# Altium project Project2.PrjPcb
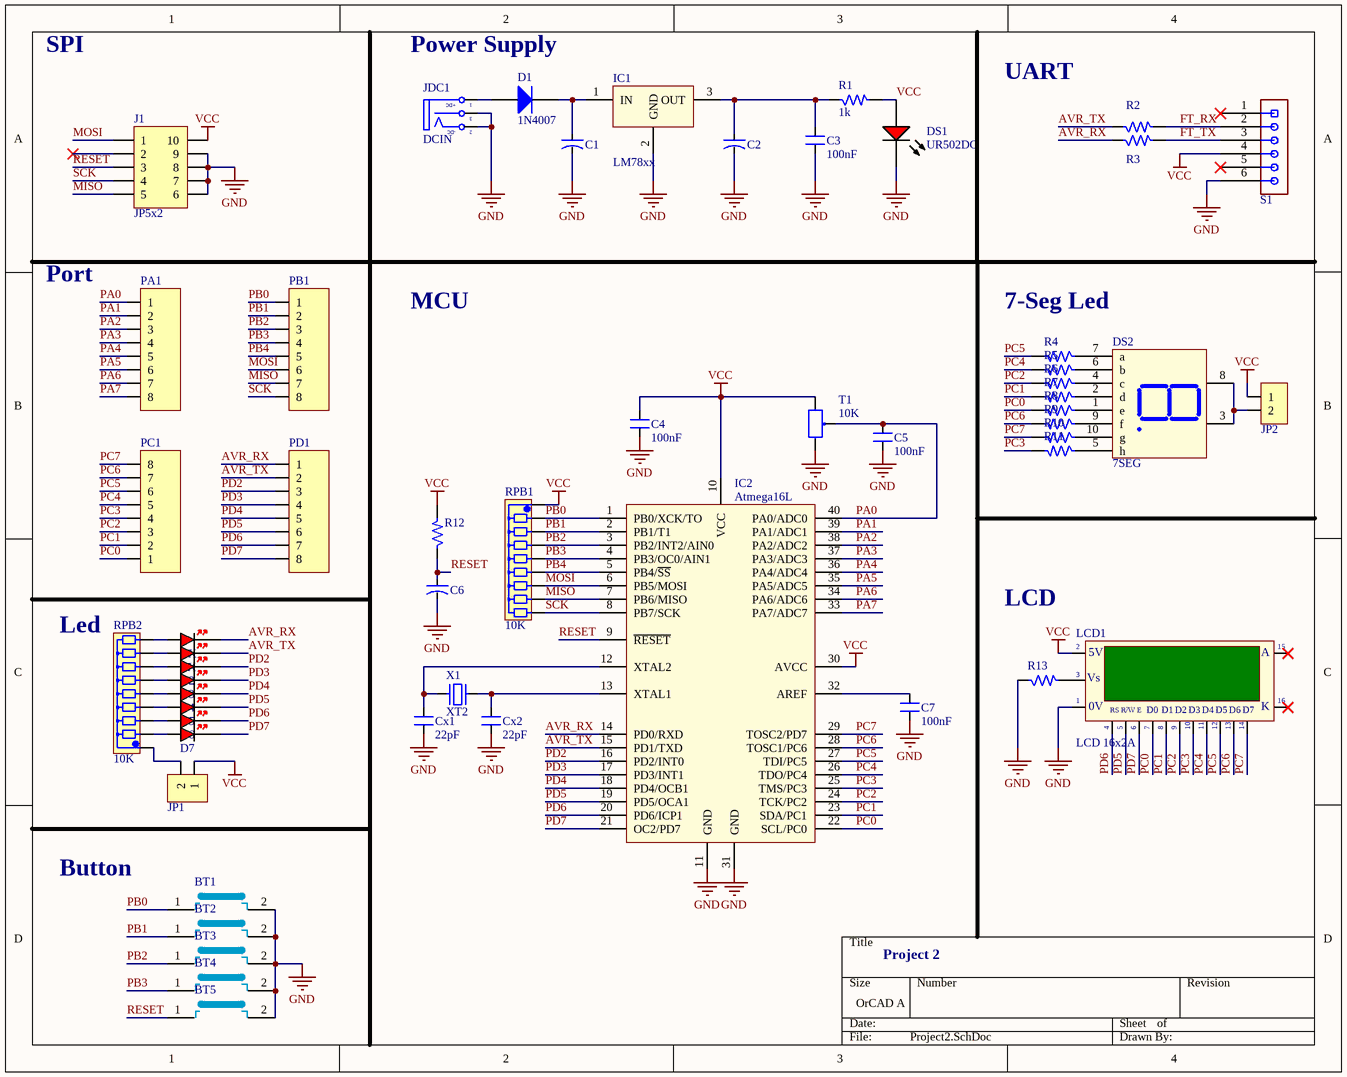
[diagram p0: Project2.SchDoc]
1 sheet, 54 parts. Net scope: global (net labels, ports and power ports of the same name join across sheets).
Board file: Project2.PcbDoc

## Sheet Project2.SchDoc: Project 2
size OrCAD A; SheetNumber: 1; SheetTotal: 1

### Parts
BT1  BT  [SW4]  (value not drawn)
BT2  BT  [SW4]  (value not drawn)
BT3  BT  [SW4]  (value not drawn)
BT4  BT  [SW4]  (value not drawn)
BT5  BT  [SW4]  (value not drawn)
C1  CN-ALU-DIP  [CA-ALU-8]  (value not drawn)
C2  CN-ALU-DIP  [CA-ALU-8]  (value not drawn)
C3  value 100nF  [CN1.5]  (hidden comment: CN1.5)
C4  value 100nF  [CN1.5]  (hidden comment: CN1.5)
C5  value 100nF  [CN1.5]  (hidden comment: CN1.5)
C6  CN-ALU-DIP  [CA-ALU-5W]  (value not drawn)
C7  value 100nF  [CN1.5]  (hidden comment: CN1.5)
Cx1  value 22pF  [CN1]  (hidden comment: CN0)
Cx2  value 22pF  [CN1]  (hidden comment: CN0)
D1  1N4007  [FAIR-DO-41-2]
D2  Led Flat  [Led Flat]  (value not drawn)
D3  Led Flat  [Led Flat]  (value not drawn)
D4  Led Flat  [Led Flat]  (value not drawn)
D5  Led Flat  [Led Flat]  (value not drawn)
D6  Led Flat  [Led Flat]  (value not drawn)
D7  Led Flat  [Led Flat]  (value not drawn)
DS1  UR502DC  [CGX-UR502DC]
DS2  7SEG  [LED7SEG-1-0.56]
IC1  LM78xx  [QTO-220H3]
IC2  Atmega16L  [DIP40PIN]
J1  JP5x2  [JP5-D2T]
JDC1  DCIN  [DC-IN]
JP1  JP1  [JP2-CLOSED]  (value not drawn)
JP2  JP2  [JP2-CLOSED]  (value not drawn)
LCD1  LCD 16x2A  [LCD16X2N]
PA1  JP 1x8 2.54  [JP 1x8 DT]  (value not drawn)
PB1  JP 1x8 2.54  [JP 1x8 DT]  (value not drawn)
PC1  JP 1x8 2.54  [JP 1x8 DT]  (value not drawn)
PD1  JP 1x8 2.54  [JP 1x8 DT]  (value not drawn)
R1  1k  [R1/4W]
R2  R  [R1/4W]  (value not drawn)
R3  R  [R1/4W]  (value not drawn)
R4  R  [R1/4W]  (value not drawn)
R5  R  [R1/4W]  (value not drawn)
R6  R  [R1/4W]  (value not drawn)
R7  R  [R1/4W]  (value not drawn)
R8  R  [R1/4W]  (value not drawn)
R9  R  [R1/4W]  (value not drawn)
R10  R  [R1/4W]  (value not drawn)
R11  R  [R1/4W]  (value not drawn)
R12  R  [R1/4W]  (value not drawn)
R13  R  [R1/4W]  (value not drawn)
RPB1  10K  [RN8]
RPB2  10K  [RN8]
RX  Led Flat  [Led Flat]  (value not drawn)
S1  Socket 6P1R  [Socket 6P1R Vertical]  (value not drawn)
T1  10K  [BIEN TRO VI CHINH NAM]
TX  Led Flat  [Led Flat]  (value not drawn)
X1  XT2  [XT2]

### Nets
GND: BT1.2 BT2.2 BT3.2 BT4.2 BT5.2 C1.2 C2.2 C3.1 C4.1 C5.1 C6.2 C7.1 Cx1.1 Cx2.1 DS1.2(K) IC1.2(GND) IC2.11(GND) IC2.31(GND) J1.6 J1.7 J1.8 J1.9 JDC1.2(TN) JDC1.3(S) LCD1.1(GND) R13.1 S1.6 T1.3
VCC: C4.2 DS1.1(A) IC2.10(VCC) IC2.30(AVCC) J1.10 JP1.1 JP2.1 LCD1.2(VDD) R1.2 R12.2 RPB1.1 S1.4 T1.1
AVR_RX: IC2.14(PD0/RXD) PD1.1 R3.1 RX.K
AVR_TX: IC2.15(PD1/TXD) PD1.2 R2.1 TX.K
FT_RX: R2.2 S1.2
FT_TX: R3.2 S1.3
MISO: IC2.7(PB6/MISO) J1.5 PB1.7 RPB1.8
MOSI: IC2.6(PB5/MOSI) J1.1 PB1.6 RPB1.7
PA0: C5.2 IC2.40(PA0/ADC0) PA1.1 T1.2
PA1: IC2.39(PA1/ADC1) PA1.2
PA2: IC2.38(PA2/ADC2) PA1.3
PA3: IC2.37(PA3/ADC3) PA1.4
PA4: IC2.36(PA4/ADC4) PA1.5
PA5: IC2.35(PA5/ADC5) PA1.6
PA6: IC2.34(PA6/ADC6) PA1.7
PA7: IC2.33(PA7/ADC7) PA1.8
PB0: BT1.1 IC2.1(PB0/XCK/TO) PB1.1 RPB1.2
PB1: BT2.1 IC2.2(PB1/T1) PB1.2 RPB1.3
PB2: BT3.1 IC2.3(PB2/INT2/AIN0) PB1.3 RPB1.4
PB3: BT4.1 IC2.4(PB3/OC0/AIN1) PB1.4 RPB1.5
PB4: IC2.5(PB4/~{SS}) PB1.5 RPB1.6
PC0: IC2.22(SCL/PC0) LCD1.7(D0) PC1.1 R8.2
PC1: IC2.23(SDA/PC1) LCD1.8(D1) PC1.2 R7.2
PC2: IC2.24(TCK/PC2) LCD1.9(D2) PC1.3 R6.2
PC3: IC2.25(TMS/PC3) LCD1.10(D3) PC1.4 R11.2
PC4: IC2.26(TDO/PC4) LCD1.11(D4) PC1.5 R5.2
PC5: IC2.27(TDI/PC5) LCD1.12(D5) PC1.6 R4.2
PC6: IC2.28(TOSC1/PC6) LCD1.13(D6) PC1.7 R9.2
PC7: IC2.29(TOSC2/PD7) LCD1.14(D7) PC1.8 R10.2
PD2: D2.K IC2.16(PD2/INT0) PD1.3
PD3: D3.K IC2.17(PD3/INT1) PD1.4
PD4: D4.K IC2.18(PD4/OCB1) PD1.5
PD5: D5.K IC2.19(PD5/OCA1) LCD1.5(R/~{W}) PD1.6
PD6: D6.K IC2.20(PD6/ICP1) LCD1.4(RS) PD1.7
PD7: D7.K IC2.21(OC2/PD7) LCD1.6(~{EN}) PD1.8
RESET: BT5.1 C6.1 IC2.9(~{RESET}) J1.3 R12.1
SCK: IC2.8(PB7/SCK) J1.4 PB1.8 RPB1.9
NetC1_1: C1.1 D1.1(K) IC1.1(IN)
NetC2_1: C2.1 C3.2 IC1.3(OUT) R1.1
NetC7_2: C7.2 IC2.32(AREF)
NetCx1_2: Cx1.2 IC2.12(XTAL2) X1.1
NetCx2_2: Cx2.2 IC2.13(XTAL1) X1.2
NetD1_2: D1.2(A) JDC1.1(T)
NetD2_A: D2.A RPB2.7
NetD3_A: D3.A RPB2.6
NetD4_A: D4.A RPB2.5
NetD5_A: D5.A RPB2.4
NetD6_A: D6.A RPB2.3
NetD7_A: D7.A RPB2.2
NetDS2_1: DS2.1(e) R8.1
NetDS2_2: DS2.2(d) R7.1
NetDS2_3: DS2.3(Vcc) DS2.8(Vcc) JP2.2
NetDS2_4: DS2.4(c) R6.1
NetDS2_5: DS2.5(h) R11.1
NetDS2_6: DS2.6(b) R5.1
NetDS2_7: DS2.7(a) R4.1
NetDS2_9: DS2.9(f) R9.1
NetDS2_10: DS2.10(g) R10.1
NetJP1_2: JP1.2 RPB2.1
NetLCD1_3: LCD1.3(VEE) R13.2
NetRPB2_8: RPB2.8 TX.A
NetRPB2_9: RPB2.9 RX.A

Not connected (* = marked no-connect by the designer): J1 2*; LCD1 15(A)* 16(K)*; S1 1* 5*

### Notes on the sheet
- SPI
- Power Supply
- UART
- (near PA1) Port
- MCU
- 7-Seg Led
- LCD
- Led
- Button
- (in symbol CMP-007-000003-1) +DC; -DC
- (in symbol LCD16x2A) 5V; Vs; |; 0V; R/W; E

### Library data of the parts
BT1-BT5 = BUTTON
C1 C2 = CN-ALU-DIP: Capacitor (Semiconductor SIM Model); Value: 104; LatestRevisionDate: 17-Jul-2002; LatestRevisionNote: Re-released for DXP Platform.; PackageReference: C1206; Publisher: Altium Limited
C3-C5 C7 = CMP-001-00086-1: Cap np Cremic  682pF => 104 pF; Design Item ID: CN1.5; Component Type: Standard; Source: syhaunguyen.SchLib; Pins: 2
C6 = CN-ALU-DIP: Capacitor (Semiconductor SIM Model); pin to pad: 1>2 2>1; Value: 104; LatestRevisionDate: 17-Jul-2002; LatestRevisionNote: Re-released for DXP Platform.; PackageReference: C1206; Publisher: Altium Limited
Cx1 Cx2 = CMP-001-00084-1: Cap np Cremic value 1pF => 100pF; Pins: 2; Component Type: Standard; Source: syhaunguyen.SchLib; Design Item ID: CN0
D1 = CMP-004-00007-2: General Purpose Rectifier, 1.1 V, 1.0 A, -55 to 175 degC, 2-Pin DO-41, RoHS, Tape and Reel; Manufacturer: Fairchild; Peak Reverse Current: 5uA; Max Surge Current: 30A; Elements: 1; Forward Voltage: 1.1V; Package Version: Rev. 2, 09/2008; Forward Current: 1A; Package Quantity: 5000; Packaging: TapeandReel; Package URL: http://www.fairchildsemi.com/dwg/DO/DO41A.pdf; Manufacturer URL: https://www.fairchildsemi.com/; Package Reference: DO-41-2; Pins: 2; Min Operating Temperature: -55°C; Datasheet Version: Rev. 1.1.0, 11/2014; Max Operating Temperature: 175°C; RoHS Compliant: True; Case/Package: DO-41-2; Mounting Technology: TH; Package Description: 2-Pin Axial Lead, Dia 2.375 mm, Body Length 4.63 mm; Datasheet URL: https://www.fairchildsemi.com/datasheets/1N/1N4007.pdf
D2-D7 RX TX = Led Flat: Led Flat 2x5mm
DS1 = CMP-007-00009-2: Red LED, 80 mW, 30 mA, -25 to 85 degC, 2-Pin THD; Manufacturer: Shenzhen CGX; Power: 80mW; Case/Package: UR502DC; RoHS Compliant: Unknown; Package Description: 2-Pin Through Hole Device, Dia 5.9 mm, Height 9.1 mm; Manufacturer URL: http://szcgx.com/; Datasheet Version: Sep-14; Package Reference: UR502DC; Datasheet URL: http://datasheet.octopart.com/UR502DC-Chengguangxing-datasheet-62330342.pdf; Mounting Technology: TH
DS2 = LED7SEG-1: 14.2 mm General Purpose Blue 7-Segment Display: CC, RH DP, Gray Surface; MinimumIntensity: 2020 ucd; Note: IF = 10 mA; Published: 8-Jun-2000; LatestRevisionDate: 17-Dec-2003; LatestRevisionNote: Schematic revised, PCB Footprint replaced.; DatasheetDocument: 24-Sep-2002; PackageDocument: 24-Sep-2002; PackageReference: H; Publisher: Altium Limited; Colour: Blue; ComponentLink1Description: Manufacturer Link; ComponentLink1URL: http://www.agilent.com/
IC1 = CMP-031-00092-2: Low-Power Dual Operational Amplifier; Value: LM358; Source: syhaunguyen.SchLib; Component Type: Standard; Pins: 8; Design Item ID: LM78xx
IC2 = CMP-031-00059-3: 8-Bit AVR Microcontroller with 16K Bytes of In-System Programmable Flash Memory; Component Type: Standard; Value: Atmega 16L; Source: syhaunguyen.SchLib; Pins: 40; Design Item ID: Atmega16L
J1 = JP5x2: WR-PHD 2.54 mm Dual Socket Header; Manufacturer: W¨¹rth Elektronik eiSos GmbH; partNo: 61301021821; ComponentLink1 Description: Manufacturer; ComponentLink2 Description: Datasheet; NoPins: 10; Created Date: 29 March 2013; ComponentLink1URL: http://www.we-online.com; ComponentLink2URL: http://katalog.we-online.de/em/datasheet/6130xx21821.pdf; Created by: Karrer Zheng
JDC1 = CMP-007-000003-1: Jac DC input; Value: Jac DC; Component Type: Standard; Pin Count: 3; Source: syhaunguyen.SchLib; Design Item ID: DCIN
JP1 JP2 = JP2: WR-PHD 2.54 mm Angled Socket Header; Manufacturer: W¨¹rth Elektronik eiSos GmbH; partNo: 613002143121; ComponentLink1 Description: Manufacturer; ComponentLink2 Description: Datasheet; NoPins: 02; Created Date: 29 March 2013; ComponentLink1URL: http://www.we-online.com; ComponentLink2URL: http://katalog.we-online.de/em/datasheet/6130xx143121.pdf; Created by: Karrer Zheng
LCD1 = LCD16x2A: LCD dipslay 16 char, 2 line; Value: LCD16x2A
PA1 PB1 PC1 PD1 = JP 1x8 2.54 Duc Thang: Cắm; Ten_Linh_Kien: Jump Đơn Đực 2.54MM 1x40P Thẳng 11MM; Don_Vi: Con; Ma_Hang: MH000903; Ghi_Chu: *; Kieu_Chan: *; Chung_Loai: Cắm
R1 = R: Resistor 1/4W; Value: R1/4W - 1K
R2-R13 = CMP-009-00186-1: Resistor 1/4W; Pad Count: 3; Design Item ID: R; Height: 0; Source: heromap.SchLib
RPB1 RPB2 = RN8: Resistor 8 (Thanh); Value: Tro thanh 10K
S1 = Socket 6P1R: Socket 6Pins x 1Rows
T1 = Bien Tro Tinh Chinh 10K Nam: Cắm; Ma_Hang: MH003232; Ten_Linh_Kien: Biến Trở VR 103-10K 3296W; Don_Vi: Con; Kieu_Chan: *; Chung_Loai: Cắm; Ghi_Chu: *
X1 = CMP-040-000117-1: 18 PIN, W 300mil, Pin to pin 100mil; Pad Count: 18; Height: 100; Source: heromap.SchLib; Design Item ID: XT2